# EAGLE design PT08tqfp (EAGLE 6.6.0)

## Sheet 1 of 2
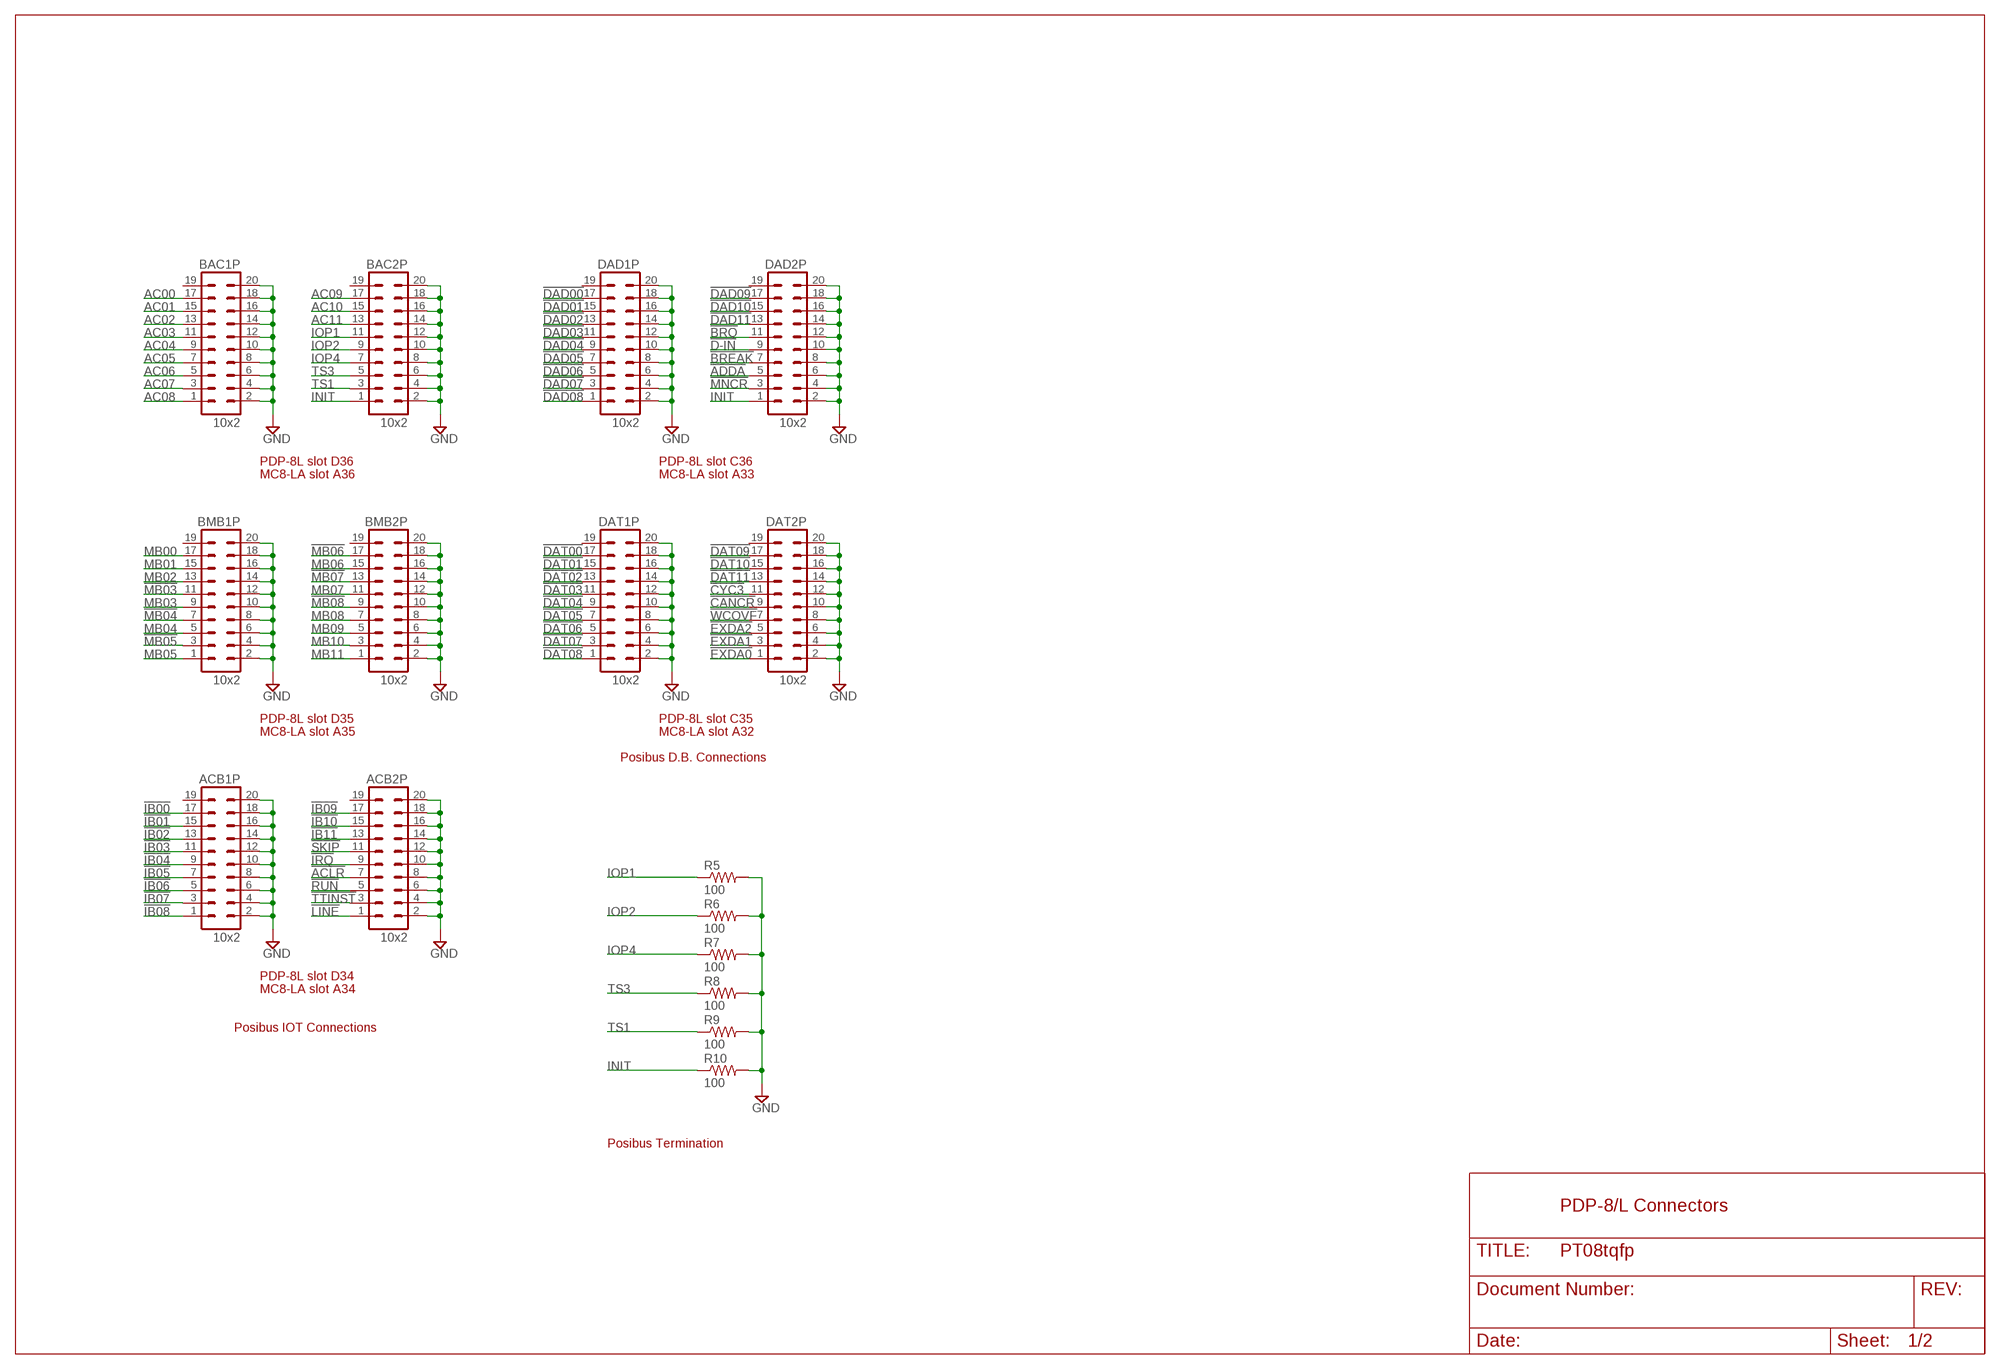
[diagram p0: schematic, sheet 1]

### Parts
ACB1P  10x2  MA10-2  [MA10-2]
ACB2P  10x2  MA10-2  [MA10-2]
BAC1P  10x2  MA10-2  [MA10-2]
BAC2P  10x2  MA10-2  [MA10-2]
BMB1P  10x2  MA10-2  [MA10-2]
BMB2P  10x2  MA10-2  [MA10-2]
DAD1P  10x2  MA10-2  [MA10-2]
DAD2P  10x2  MA10-2  [MA10-2]
DAT1P  10x2  MA10-2  [MA10-2]
DAT2P  10x2  MA10-2  [MA10-2]
R5  100  R-US_R1206  [R1206]
R6  100  R-US_R1206  [R1206]
R7  100  R-US_R1206  [R1206]
R8  100  R-US_R1206  [R1206]
R9  100  R-US_R1206  [R1206]
R10  100  R-US_R1206  [R1206]

### Nets
!ACLR: ACB2P.7 ; also sheet 2
!ADDA: DAD2P.5
!BREAK: DAD2P.7
!BRQ: DAD2P.11
!CANCR: DAT2P.9
!CYC3: DAT2P.11
!D-IN: DAD2P.9
!DAD00: DAD1P.17
!DAD01: DAD1P.15
!DAD02: DAD1P.13
!DAD03: DAD1P.11
!DAD04: DAD1P.9
!DAD05: DAD1P.7
!DAD06: DAD1P.5
!DAD07: DAD1P.3
!DAD08: DAD1P.1
!DAD09: DAD2P.17
!DAD10: DAD2P.15
!DAD11: DAD2P.13
!DAT00: DAT1P.17
!DAT01: DAT1P.15
!DAT02: DAT1P.13
!DAT03: DAT1P.11
!DAT04: DAT1P.9
!DAT05: DAT1P.7
!DAT06: DAT1P.5
!DAT07: DAT1P.3
!DAT08: DAT1P.1
!DAT09: DAT2P.17
!DAT10: DAT2P.15
!DAT11: DAT2P.13
!EXDA0: DAT2P.1
!EXDA1: DAT2P.3
!EXDA2: DAT2P.5
!IB00: ACB1P.17 ; also sheet 2
!IB01: ACB1P.15 ; also sheet 2
!IB02: ACB1P.13 ; also sheet 2
!IB03: ACB1P.11 ; also sheet 2
!IB04: ACB1P.9 ; also sheet 2
!IB05: ACB1P.7 ; also sheet 2
!IB06: ACB1P.5 ; also sheet 2
!IB07: ACB1P.3 ; also sheet 2
!IB08: ACB1P.1 ; also sheet 2
!IB09: ACB2P.17 ; also sheet 2
!IB10: ACB2P.15 ; also sheet 2
!IB11: ACB2P.13 ; also sheet 2
!IRQ: ACB2P.9 ; also sheet 2
!LINE: ACB2P.1 ; also sheet 2
!MB03: BMB1P.11
!MB04: BMB1P.7
!MB05: BMB1P.3
!MB06: BMB2P.17
!MB07: BMB2P.13
!MB08: BMB2P.9
!MNCR: DAD2P.3
!RUN: ACB2P.5 ; also sheet 2
!SKIP: ACB2P.11 ; also sheet 2
!TTINST: ACB2P.3 ; also sheet 2
!WCOVF: DAT2P.7
AC00: BAC1P.17 ; also sheet 2
AC01: BAC1P.15 ; also sheet 2
AC02: BAC1P.13 ; also sheet 2
AC03: BAC1P.11 ; also sheet 2
AC04: BAC1P.9 ; also sheet 2
AC05: BAC1P.7 ; also sheet 2
AC06: BAC1P.5 ; also sheet 2
AC07: BAC1P.3 ; also sheet 2
AC08: BAC1P.1 ; also sheet 2
AC09: BAC2P.17 ; also sheet 2
AC10: BAC2P.15 ; also sheet 2
AC11: BAC2P.13 ; also sheet 2
GND [supply]: ACB1P.2 ACB1P.4 ACB1P.6 ACB1P.8 ACB1P.10 ACB1P.12 ACB1P.14 ACB1P.16 ACB1P.18 ACB1P.20 ACB2P.2 ACB2P.4 ACB2P.6 ACB2P.8 ACB2P.10 ACB2P.12 ACB2P.14 ACB2P.16 ACB2P.18 ACB2P.20 BAC1P.2 BAC1P.4 BAC1P.6 BAC1P.8 BAC1P.10 BAC1P.12 BAC1P.14 BAC1P.16 BAC1P.18 BAC1P.20 BAC2P.2 BAC2P.4 BAC2P.6 BAC2P.8 BAC2P.10 BAC2P.12 BAC2P.14 BAC2P.16 BAC2P.18 BAC2P.20 BMB1P.2 BMB1P.4 BMB1P.6 BMB1P.8 BMB1P.10 BMB1P.12 BMB1P.14 BMB1P.16 BMB1P.18 BMB1P.20 BMB2P.2 BMB2P.4 BMB2P.6 BMB2P.8 BMB2P.10 BMB2P.12 BMB2P.14 BMB2P.16 BMB2P.18 BMB2P.20 DAD1P.2 DAD1P.4 DAD1P.6 DAD1P.8 DAD1P.10 DAD1P.12 DAD1P.14 DAD1P.16 DAD1P.18 DAD1P.20 DAD2P.2 DAD2P.4 DAD2P.6 DAD2P.8 DAD2P.10 DAD2P.12 DAD2P.14 DAD2P.16 DAD2P.18 DAD2P.20 DAT1P.2 DAT1P.4 DAT1P.6 DAT1P.8 DAT1P.10 DAT1P.12 DAT1P.14 DAT1P.16 DAT1P.18 DAT1P.20 DAT2P.2 DAT2P.4 DAT2P.6 DAT2P.8 DAT2P.10 DAT2P.12 DAT2P.14 DAT2P.16 DAT2P.18 DAT2P.20 R5.2 R6.2 R7.2 R8.2 R9.2 R10.2 ; also sheet 2
INIT: BAC2P.1 DAD2P.1 R10.1 ; also sheet 2
IOP1: BAC2P.11 R5.1 ; also sheet 2
IOP2: BAC2P.9 R6.1 ; also sheet 2
IOP4: BAC2P.7 R7.1 ; also sheet 2
MB00: BMB1P.17 ; also sheet 2
MB01: BMB1P.15 ; also sheet 2
MB02: BMB1P.13 ; also sheet 2
MB03: BMB1P.9 ; also sheet 2
MB04: BMB1P.5 ; also sheet 2
MB05: BMB1P.1 ; also sheet 2
MB06: BMB2P.15 ; also sheet 2
MB07: BMB2P.11 ; also sheet 2
MB08: BMB2P.7 ; also sheet 2
MB09: BMB2P.5 ; also sheet 2
MB10: BMB2P.3 ; also sheet 2
MB11: BMB2P.1 ; also sheet 2
TS1: BAC2P.3 R9.1 ; also sheet 2
TS3: BAC2P.5 R8.1 ; also sheet 2
Unconnected: ACB1P.19 ACB2P.19 BAC1P.19 BAC2P.19 BMB1P.19 BMB2P.19 DAD1P.19 DAD2P.19 DAT1P.19 DAT2P.19

### Notes on the sheet
- PDP-8L slot D36 | PDP-8L slot C36
- MC8-LA slot A36 | MC8-LA slot A33
- PDP-8L slot D35 | PDP-8L slot C35
- MC8-LA slot A35 | MC8-LA slot A32
- Posibus D.B. Connections
- PDP-8L slot D34
- MC8-LA slot A34
- Posibus IOT Connections
- Posibus Termination
- PDP-8/L Connectors

## Sheet 2 of 2
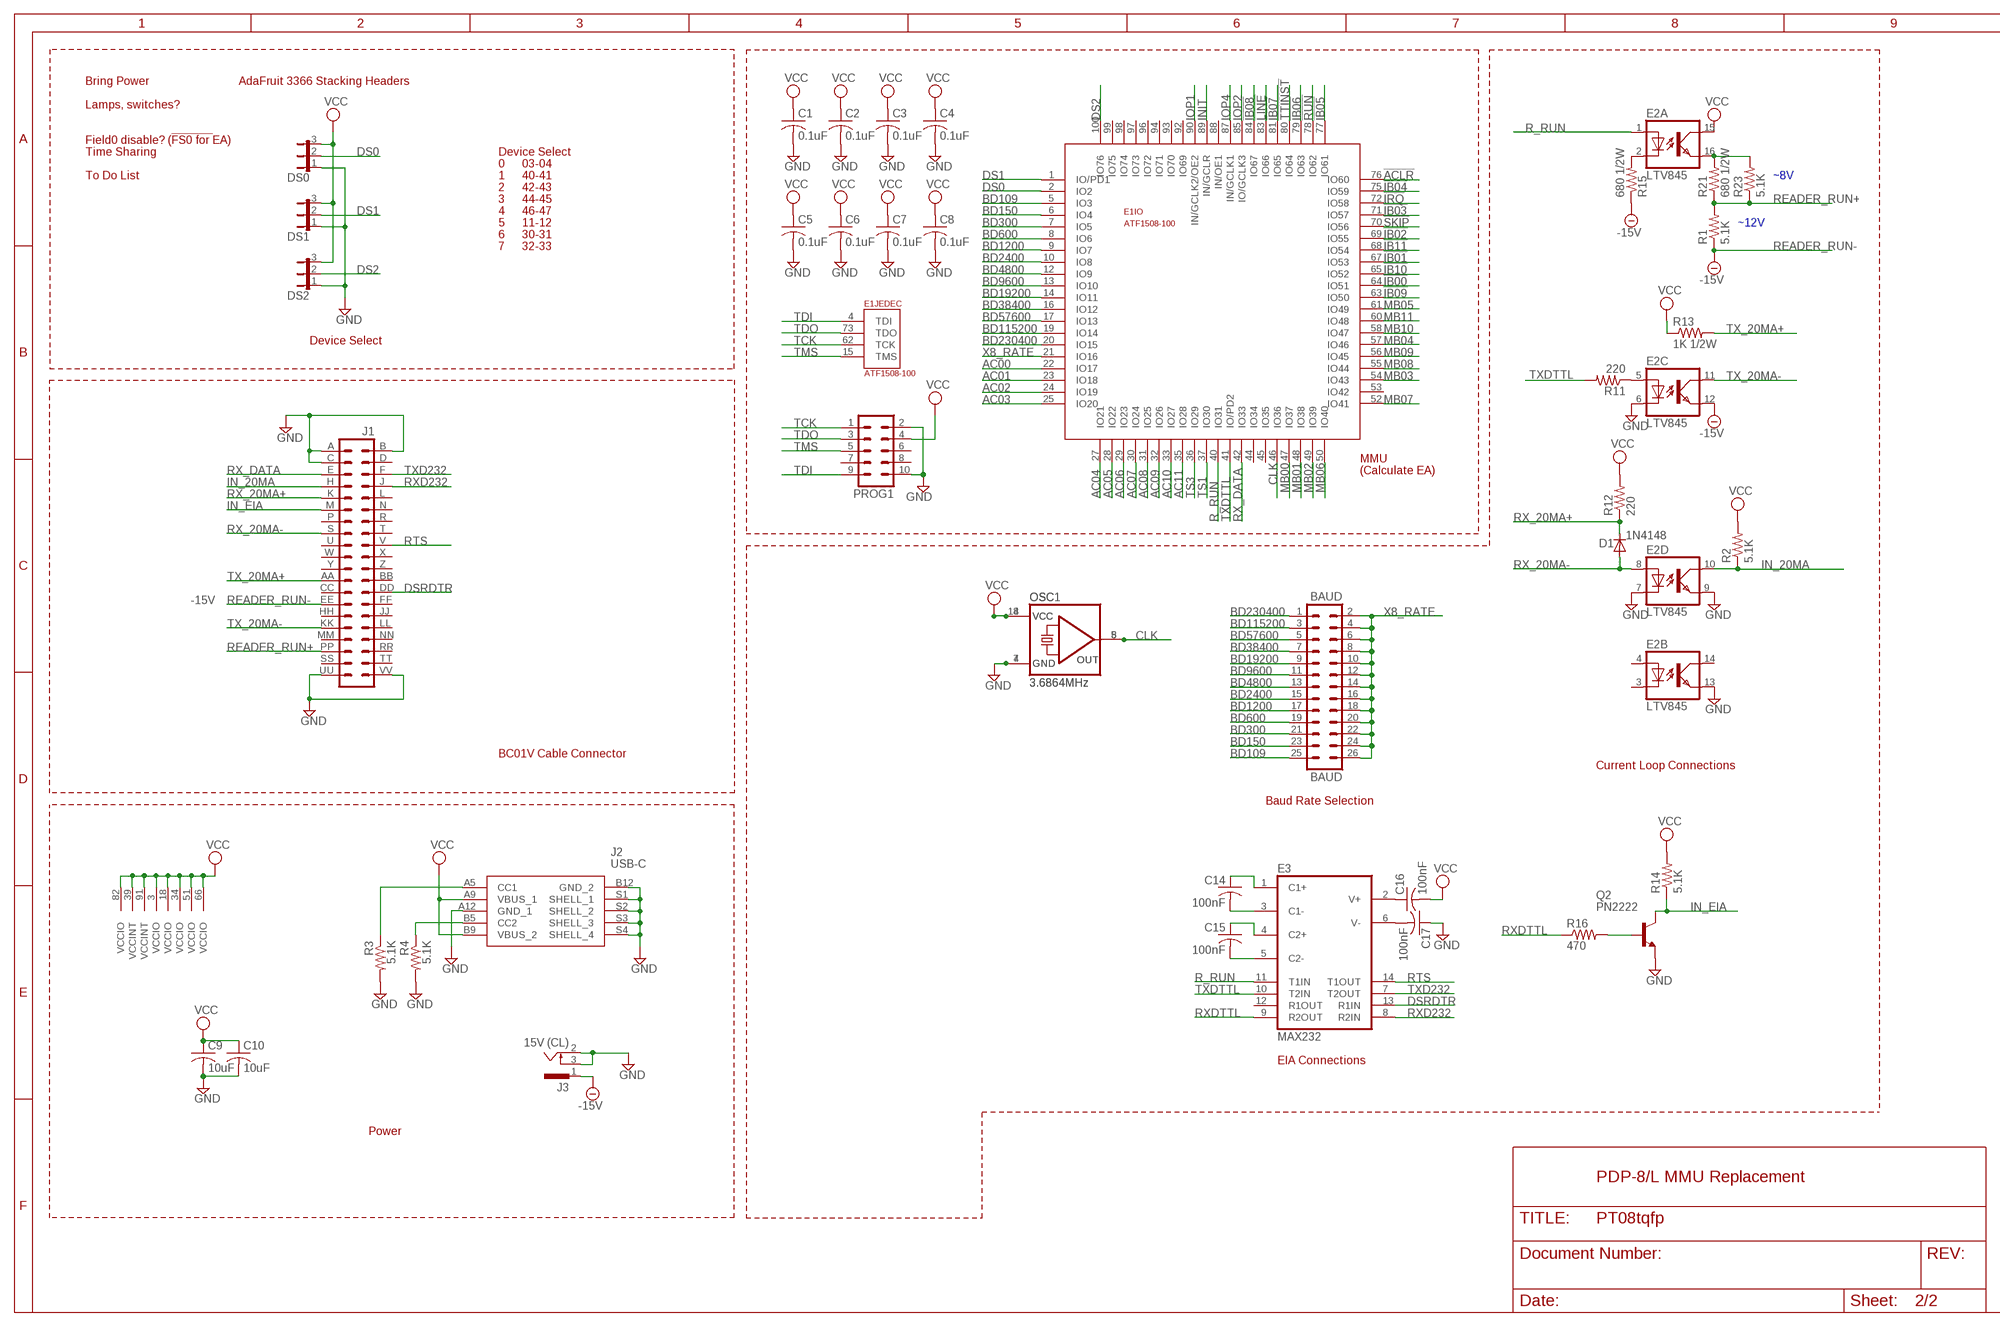
[diagram p1: schematic, sheet 2, part 1 of 2]
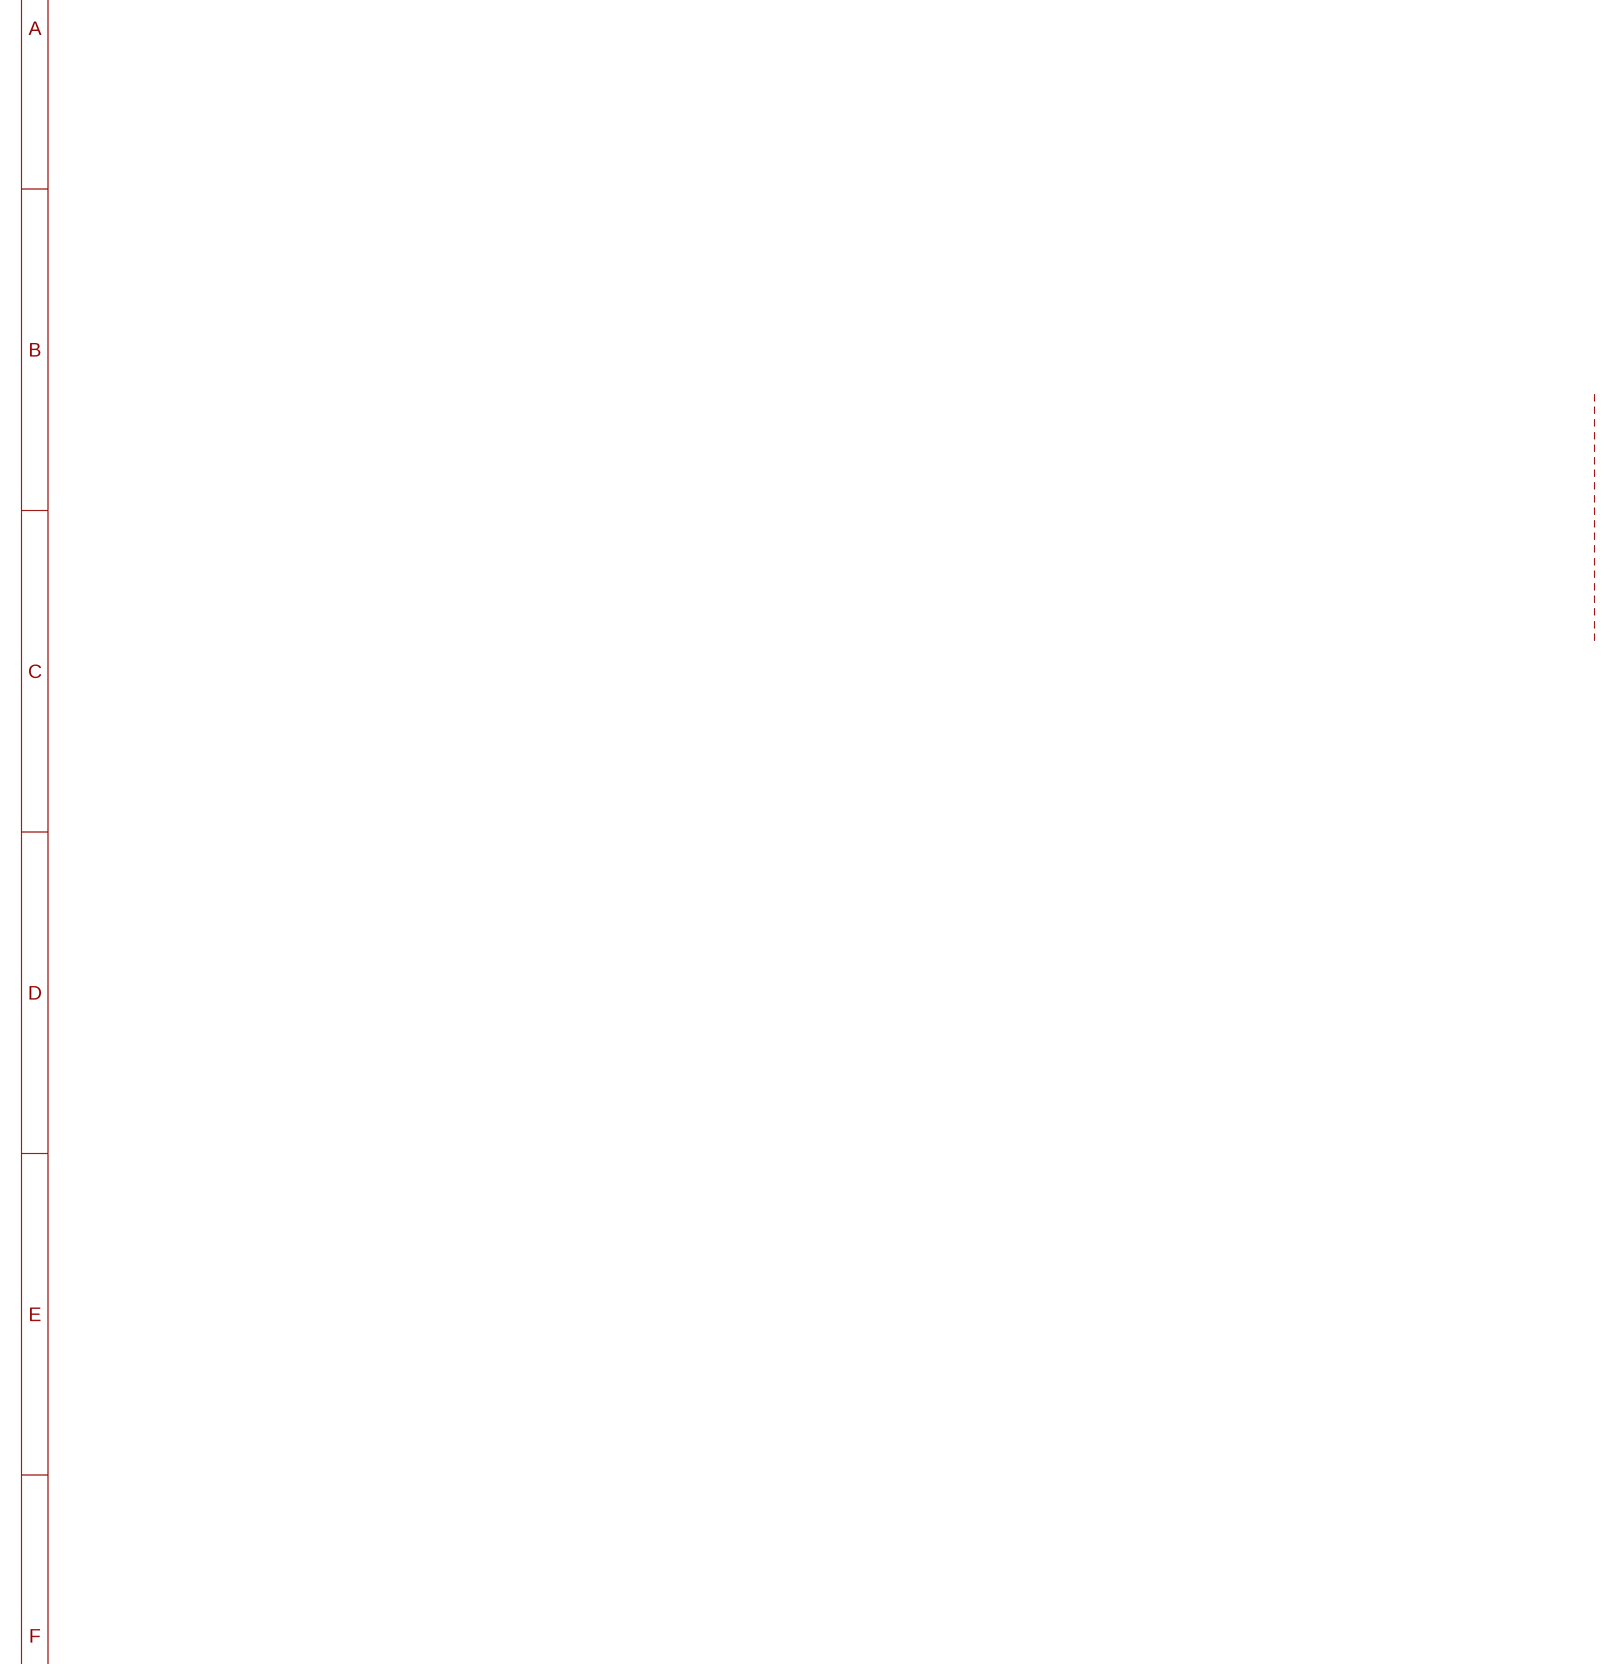
[diagram p2: schematic, sheet 2, part 2 of 2]

### Parts
BAUD  BAUD  MA13-2  [MA13-2]
C1  0.1uF  C-USC0805  [C0805]
C2  0.1uF  C-USC0805  [C0805]
C3  0.1uF  C-USC0805  [C0805]
C4  0.1uF  C-USC0805  [C0805]
C5  0.1uF  C-USC0805  [C0805]
C6  0.1uF  C-USC0805  [C0805]
C7  0.1uF  C-USC0805  [C0805]
C8  0.1uF  C-USC0805  [C0805]
C9  10uF  C-USC0805  [C0805]
C10  10uF  C-USC0805  [C0805]
C14  100nF  C-USC0805  [C0805]
C15  100nF  C-USC0805  [C0805]
C16  100nF  C-USC0805  [C0805]
C17  100nF  C-USC0805  [C0805]
D1  1N4148  DIODE-SOD323-W  [SOD323-W]
DS0  JP2E  [JP2]
DS1  JP2E  [JP2]
DS2  JP2E  [JP2]
E1  ATF1508-100  ATF150X100TQFP  [TQFP-100]
E2  LTV845  ILQ1  [DIL16]
E3  MAX232  [DIL16]
J1  DEC40PINH  [DEC40PINH]
J2  USB-C  USB4970-00-A  [USB497000A]
J3  15V (CL)  SCD-014A  [SCD-014-A]
OSC  3.6864MHz  QG5460  [DIL08S]
OSC1  3.6864MHz  QG5860  [DIL14S]
PROG1  ML10  [ML10]
Q2  PN2222  -NPN-SOT23-EBC  [SOT23-EBC]
R1  5.1K  R-US_R0805  [R0805]
R2  5.1K  R-US_R0805  [R0805]
R3  5.1K  R-US_R0805  [R0805]
R4  5.1K  R-US_R0805  [R0805]
R11  220  R-US_R0805  [R0805]
R12  220  R-US_R0805  [R0805]
R13  1K 1/2W  R-US_0207/10  [0207/10]
R14  5.1K  R-US_R0805  [R0805]
R15  680 1/2W  R-US_0207/10  [0207/10]
R16  470  R-US_R0805  [R0805]
R21  680 1/2W  R-US_0207/10  [0207/10]
R23  5.1K  R-US_R0805  [R0805]

### Nets
!ACLR: E1.76(IO:IO60) ; also sheet 1
!IB00: E1.64(IO:IO51) ; also sheet 1
!IB01: E1.67(IO:IO53) ; also sheet 1
!IB02: E1.69(IO:IO55) ; also sheet 1
!IB03: E1.71(IO:IO57) ; also sheet 1
!IB04: E1.75(IO:IO59) ; also sheet 1
!IB05: E1.77(IO:IO61) ; also sheet 1
!IB06: E1.79(IO:IO63) ; also sheet 1
!IB07: E1.81(IO:IO65) ; also sheet 1
!IB08: E1.84(IO:IO67) ; also sheet 1
!IB09: E1.63(IO:IO50) ; also sheet 1
!IB10: E1.65(IO:IO52) ; also sheet 1
!IB11: E1.68(IO:IO54) ; also sheet 1
!IRQ: E1.72(IO:IO58) ; also sheet 1
!LINE: E1.83(IO:IO66) ; also sheet 1
!RUN: E1.78(IO:IO62) ; also sheet 1
!SKIP: E1.70(IO:IO56) ; also sheet 1
!TTINST: E1.80(IO:IO64) ; also sheet 1
-15V [supply]: E2.12(C:EMIT) J1.EE J3.1 R1.1 R15.1
AC00: E1.22(IO:IO17) ; also sheet 1
AC01: E1.23(IO:IO18) ; also sheet 1
AC02: E1.24(IO:IO19) ; also sheet 1
AC03: E1.25(IO:IO20) ; also sheet 1
AC04: E1.27(IO:IO21) ; also sheet 1
AC05: E1.28(IO:IO22) ; also sheet 1
AC06: E1.29(IO:IO23) ; also sheet 1
AC07: E1.30(IO:IO24) ; also sheet 1
AC08: E1.31(IO:IO25) ; also sheet 1
AC09: E1.32(IO:IO26) ; also sheet 1
AC10: E1.33(IO:IO27) ; also sheet 1
AC11: E1.35(IO:IO28) ; also sheet 1
BD109: BAUD.25 E1.5(IO:IO3)
BD150: BAUD.23 E1.6(IO:IO4)
BD300: BAUD.21 E1.7(IO:IO5)
BD600: BAUD.19 E1.8(IO:IO6)
BD1200: BAUD.17 E1.9(IO:IO7)
BD2400: BAUD.15 E1.10(IO:IO8)
BD4800: BAUD.13 E1.12(IO:IO9)
BD9600: BAUD.11 E1.13(IO:IO10)
BD19200: BAUD.9 E1.14(IO:IO11)
BD38400: BAUD.7 E1.16(IO:IO12)
BD57600: BAUD.5 E1.17(IO:IO13)
BD115200: BAUD.3 E1.19(IO:IO14)
BD230400: BAUD.1 E1.20(IO:IO15)
CLK: E1.46(IO:IO36) OSC1.8(OUT) OSC.5(OUT)
DS0: DS0.2 E1.2(IO:IO2)
DS1: DS1.2 E1.1(IO:IO/PD1)
DS2: DS2.2 E1.100(IO:IO76)
DSRDTR: E3.13(R1IN) J1.DD
GND [supply]: C1.2 C2.2 C3.2 C4.2 C5.2 C6.2 C7.2 C8.2 C9.2 C10.2 C17.1 DS0.1 DS1.1 DS2.1 E2.6(C:C) E2.7(D:C) E2.9(D:EMIT) E2.13(B:EMIT) J1.A J1.B J1.C J1.UU J1.VV J2.A12(GND_1) J2.B12(GND_2) J2.S1(SHELL_1) J2.S2(SHELL_2) J2.S3(SHELL_3) J2.S4(SHELL_4) J3.2 J3.3 OSC1.7(GND) OSC.4(GND) PROG1.2 PROG1.10 Q2.E R3.2 R4.2 ; also sheet 1
IN_20MA: E2.10(D:COL) J1.H R2.1
IN_EIA: J1.M Q2.C R14.1
INIT: E1.89(IO:IN/GCLR) ; also sheet 1
IOP1: E1.90(IO:IN/GCLK2/OE2) ; also sheet 1
IOP2: E1.85(IO:IO/GCLK3) ; also sheet 1
IOP4: E1.87(IO:IN/GCLK1) ; also sheet 1
MB00: E1.47(IO:IO37) ; also sheet 1
MB01: E1.48(IO:IO38) ; also sheet 1
MB02: E1.49(IO:IO39) ; also sheet 1
MB03: E1.54(IO:IO43) ; also sheet 1
MB04: E1.57(IO:IO46) ; also sheet 1
MB05: E1.61(IO:IO49) ; also sheet 1
MB06: E1.50(IO:IO40) ; also sheet 1
MB07: E1.52(IO:IO41) ; also sheet 1
MB08: E1.55(IO:IO44) ; also sheet 1
MB09: E1.56(IO:IO45) ; also sheet 1
MB10: E1.58(IO:IO47) ; also sheet 1
MB11: E1.60(IO:IO48) ; also sheet 1
N$1: J2.B5(CC2) R4.1
N$2: E2.2(A:C) R15.2
N$5: J2.A5(CC1) R3.1
N$7: E2.16(A:EMIT) R21.2 R23.2
N$11: Q2.B R16.2
N$15: E2.5(C:A) R11.1
N$16: C17.2 E3.6(V-)
N$17: C14.1 E3.1(C1+)
N$827: C14.2 E3.3(C1-)
N$914: C15.2 E3.5(C2-)
N$915: C15.1 E3.4(C2+)
N$916: C16.1 E3.2(V+)
R_RUN: E1.40(IO:IO31) E2.1(A:A) E3.11(T1IN)
READER_RUN+ [supply]: J1.PP R1.2 R21.1 R23.1
RTS: E3.14(T1OUT) J1.V
RX_20MA+ [supply]: D1.C J1.K R12.1
RX_20MA- [supply]: D1.A E2.8(D:A) J1.S
RX_DATA: E1.42(IO:IO33) J1.E
RXD232: E3.8(R2IN) J1.J
RXDTTL: E3.9(R2OUT) R16.1
TCK: E1.62(JEDEC:TCK) PROG1.1
TDI: E1.4(JEDEC:TDI) PROG1.9
TDO: E1.73(JEDEC:TDO) PROG1.3
TMS: E1.15(JEDEC:TMS) PROG1.5
TS1: E1.37(IO:IO30) ; also sheet 1
TS3: E1.36(IO:IO29) ; also sheet 1
TX_20MA+ [supply]: J1.AA R13.2
TX_20MA- [supply]: E2.11(C:COL) J1.KK
TXD232: E3.7(T2OUT) J1.F
TXDTTL: E1.41(IO:IO/PD2) E3.10(T2IN) R11.2
VCC [supply]: C1.1 C2.1 C3.1 C4.1 C5.1 C6.1 C7.1 C8.1 C9.1 C10.1 C16.2 DS0.3 DS1.3 DS2.3 E1.3(VCCIO) E1.18(VCCIO) E1.34(VCCIO) E1.39(VCCINT) E1.51(VCCIO) E1.66(VCCIO) E1.82(VCCIO) E1.91(VCCINT) E2.15(A:COL) J2.A9(VBUS_1) J2.B9(VBUS_2) OSC1.14(VCC) OSC.8(VCC) PROG1.4 R2.2 R12.2 R13.1 R14.2
X8_RATE: BAUD.2 BAUD.4 BAUD.6 BAUD.8 BAUD.10 BAUD.12 BAUD.14 BAUD.16 BAUD.18 BAUD.20 BAUD.22 BAUD.24 BAUD.26 E1.21(IO:IO16)
Unconnected: E1.44(IO:IO34) E1.45(IO:IO35) E1.53(IO:IO42) E1.88(IO:IN/OE1) E1.92(IO:IO69) E1.93(IO:IO70) E1.94(IO:IO71) E1.96(IO:IO72) E1.97(IO:IO73) E1.98(IO:IO74) E1.99(IO:IO75) E2.3(B:C) E2.4(B:A) E2.14(B:COL) E3.12(R1OUT) J1.BB J1.CC J1.D J1.FF J1.HH J1.JJ J1.L J1.LL J1.MM J1.N J1.NN J1.P J1.R J1.RR J1.SS J1.T J1.TT J1.U J1.W J1.X J1.Y J1.Z PROG1.6 PROG1.7 PROG1.8

### Notes on the sheet
- Bring Power | AdaFruit 3366 Stacking Headers
- Lamps, switches?
- Field0 disable? | (!FS0 for !EA)
- Time Sharing | Device Select
- 0 | 03-04
- To Do List | 1 | 40-41 | ~8V
- 2 | 42-43
- 3 | 44-45
- 4 | 46-47
- 5 | 11-12 | ~12V
- 6 | 30-31
- 7 | 32-33 | READER_RUN-
- Device Select
- MMU
- (Calculate EA)
- READER_RUN-
- BC01V Cable Connector
- Current Loop Connections
- Baud Rate Selection
- EIA Connections
- Power
- PDP-8/L MMU Replacement

## Power pins joined to a net without a drawn wire
GND: E1.11(GND) E1.26(GND) E1.38(GND) E1.43(GND) E1.59(GND) E1.74(GND) E1.86(GND) E1.95(GND) E3.15(GND)
VCC: E3.16(VCC)

## Library data of the parts
ACB1P ACB2P BAC1P BAC2P BMB1P BMB2P DAD1P DAD2P DAT1P DAT2P = con-lstb:MA10-2: PIN HEADER; OC_FARNELL: unknown; OC_NEWARK: unknown
BAUD = con-lstb:MA13-2: PIN HEADER; OC_FARNELL: unknown; OC_NEWARK: unknown
C1-C10 C14-C17 = rcl:C-US: CAPACITOR, American symbol
D1 = diode:DIODE-: DIODE
DS0 DS1 DS2 = jumper:JP2E: JUMPER
E1 = atmel-cpld:ATF150X100: ATF150x in 100 pin package.
E2 = optocoupler:ILQ1: SIEMENS OPTO COUPLER; MF: VISHAY/TELEFUNKEN; MPN: ILQ1; OC_FARNELL: 1469501; OC_NEWARK: 88K1954
E3 = maxim:MAX232: RS232 TRANSCEIVER; MF: MAXIM; MPN: MAX232ACPE+; OC_FARNELL: 9723773; OC_NEWARK: 68K4544
J1 = dec-con:DEC40PIN: PIN HEADER
J2 = USB4970-00-A:USB4970-00-A: USB-C (USB TYPE-C) Receptacle Connector 24 (6+18 Dummy) Position Surface Mount, Right Angle; Through Hole Source: Datasheet <3dcadmodel>; DESCRIPTION: USB-C (USB TYPE-C) Receptacle Connector 24 (6+18 Dummy) Position Surface Mount, Right Angle; Through Hole; HEIGHT: 3.41mm; MANUFACTURER_NAME: GCT (GLOBAL CONNECTOR TECHNOLOGY); MANUFACTURER_PART_NUMBER: USB4970-00-A
J3 = con-shiua-chyuan:SCD-014A: Power Jack 2.5mm; OC_FARNELL: unknown; OC_NEWARK: unknown
OSC = crystal:QG5460: CRYSTAL RESONATOR; OC_FARNELL: unknown; OC_NEWARK: unknown
OSC1 = crystal:QG5860: CRYSTAL RESONATOR; OC_FARNELL: unknown; OC_NEWARK: unknown
PROG1 = con-harting-ml:ML10: HARTING; OC_FARNELL: unknown; OC_NEWARK: unknown
Q2 = transistor:*-NPN-: NPN Transistror BF959 corrected 2008.03.06
R1-R16 R21 R23 = rcl:R-US_: RESISTOR, American symbol

## Net classes
0 default: width 0.356 mm
1 supply: width 0.356 mm

## Board
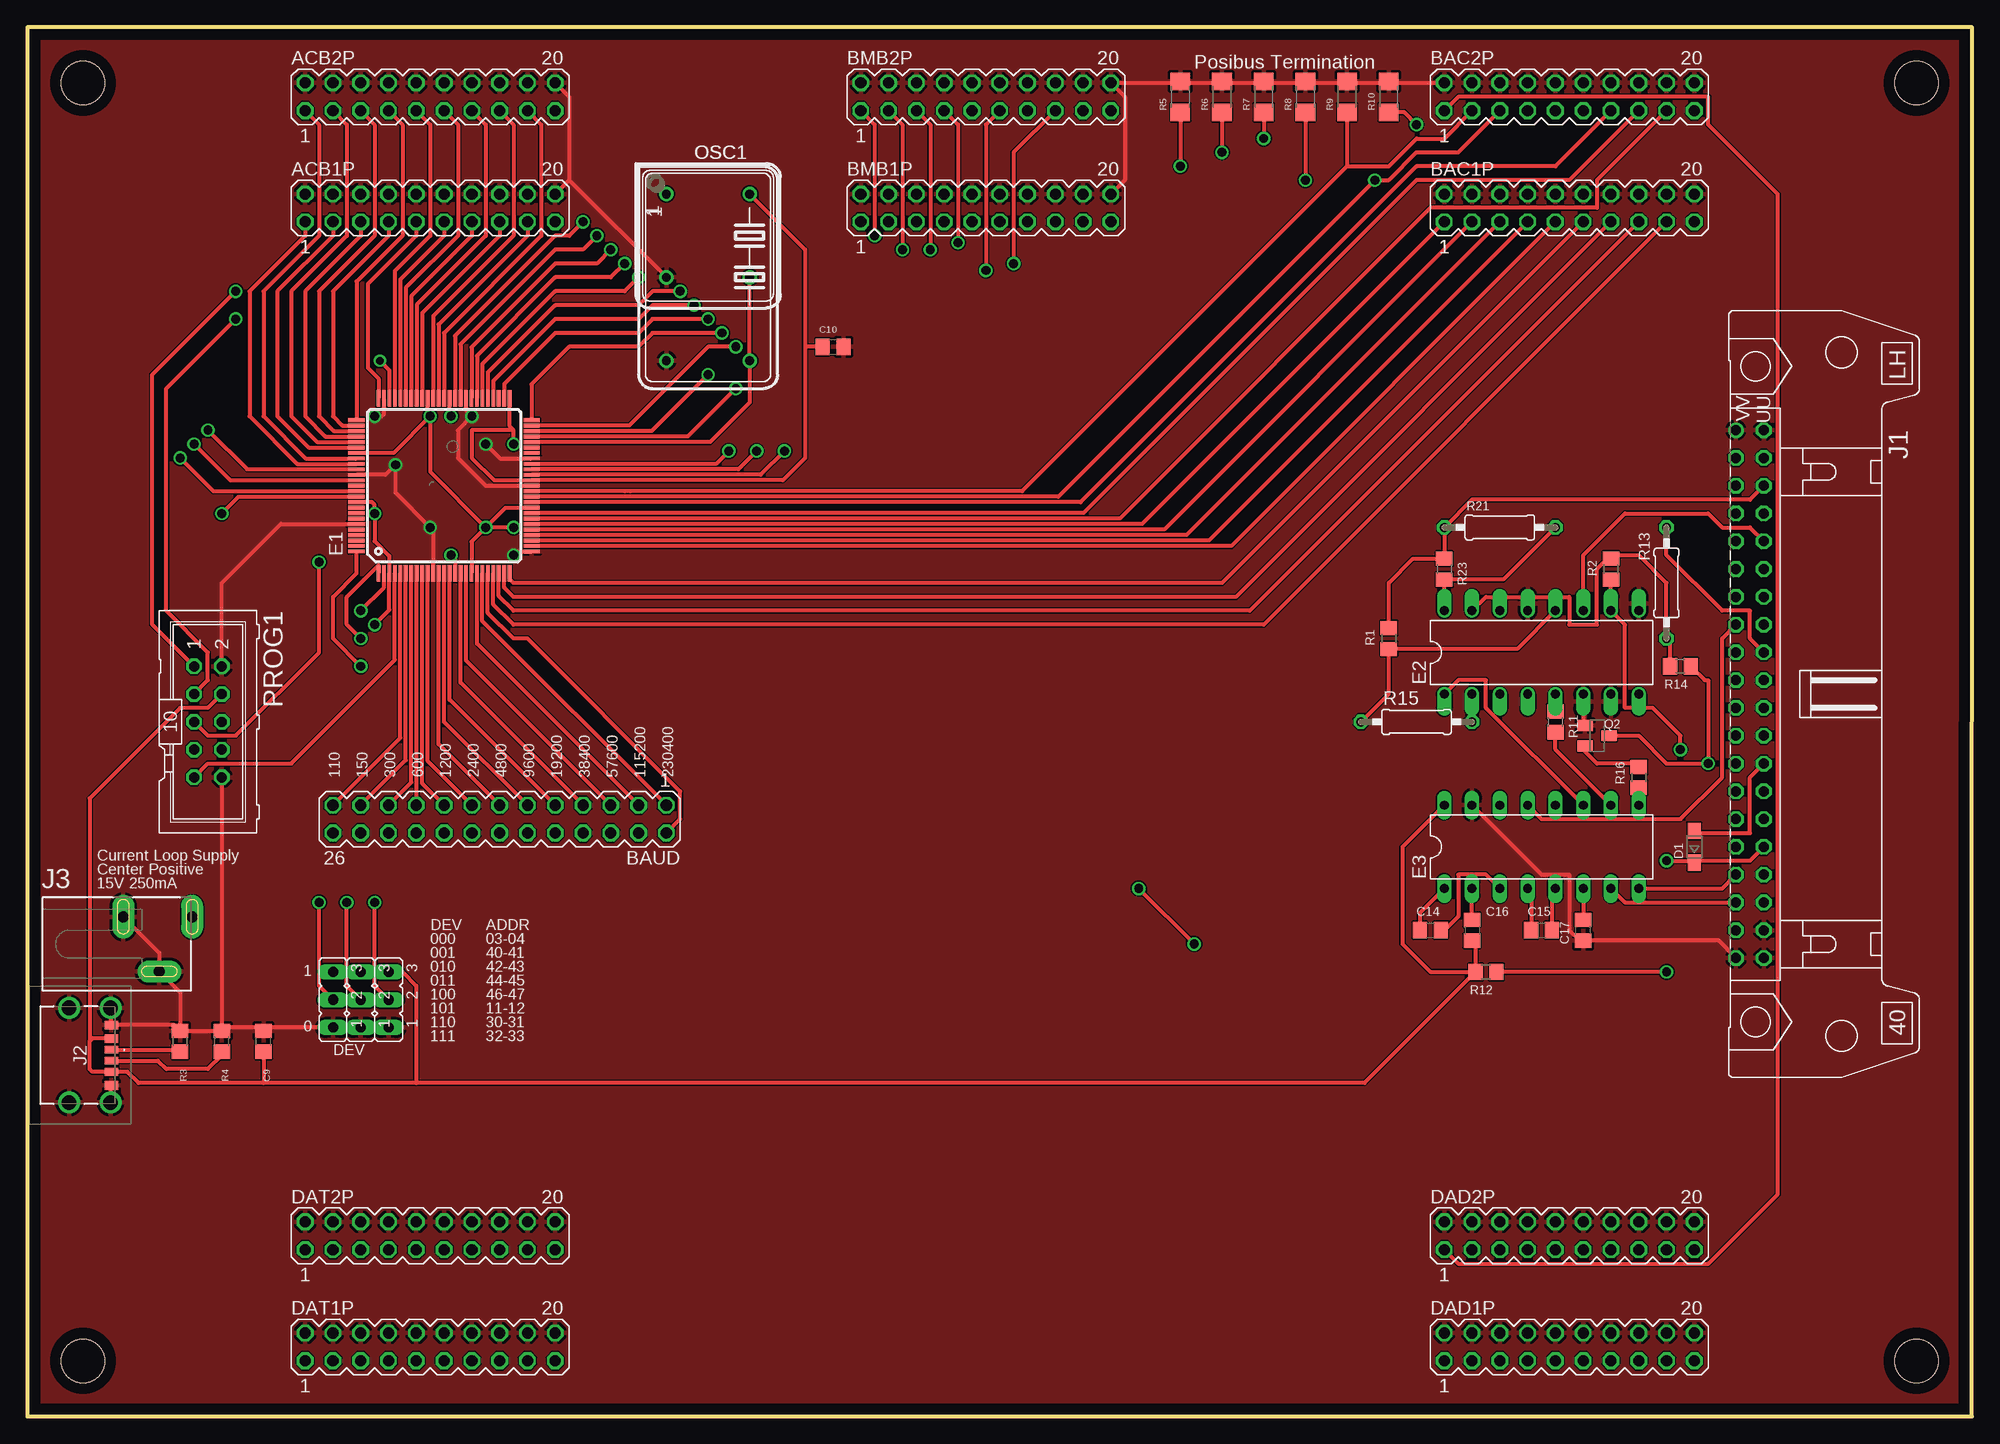
[diagram p3: board, top side]
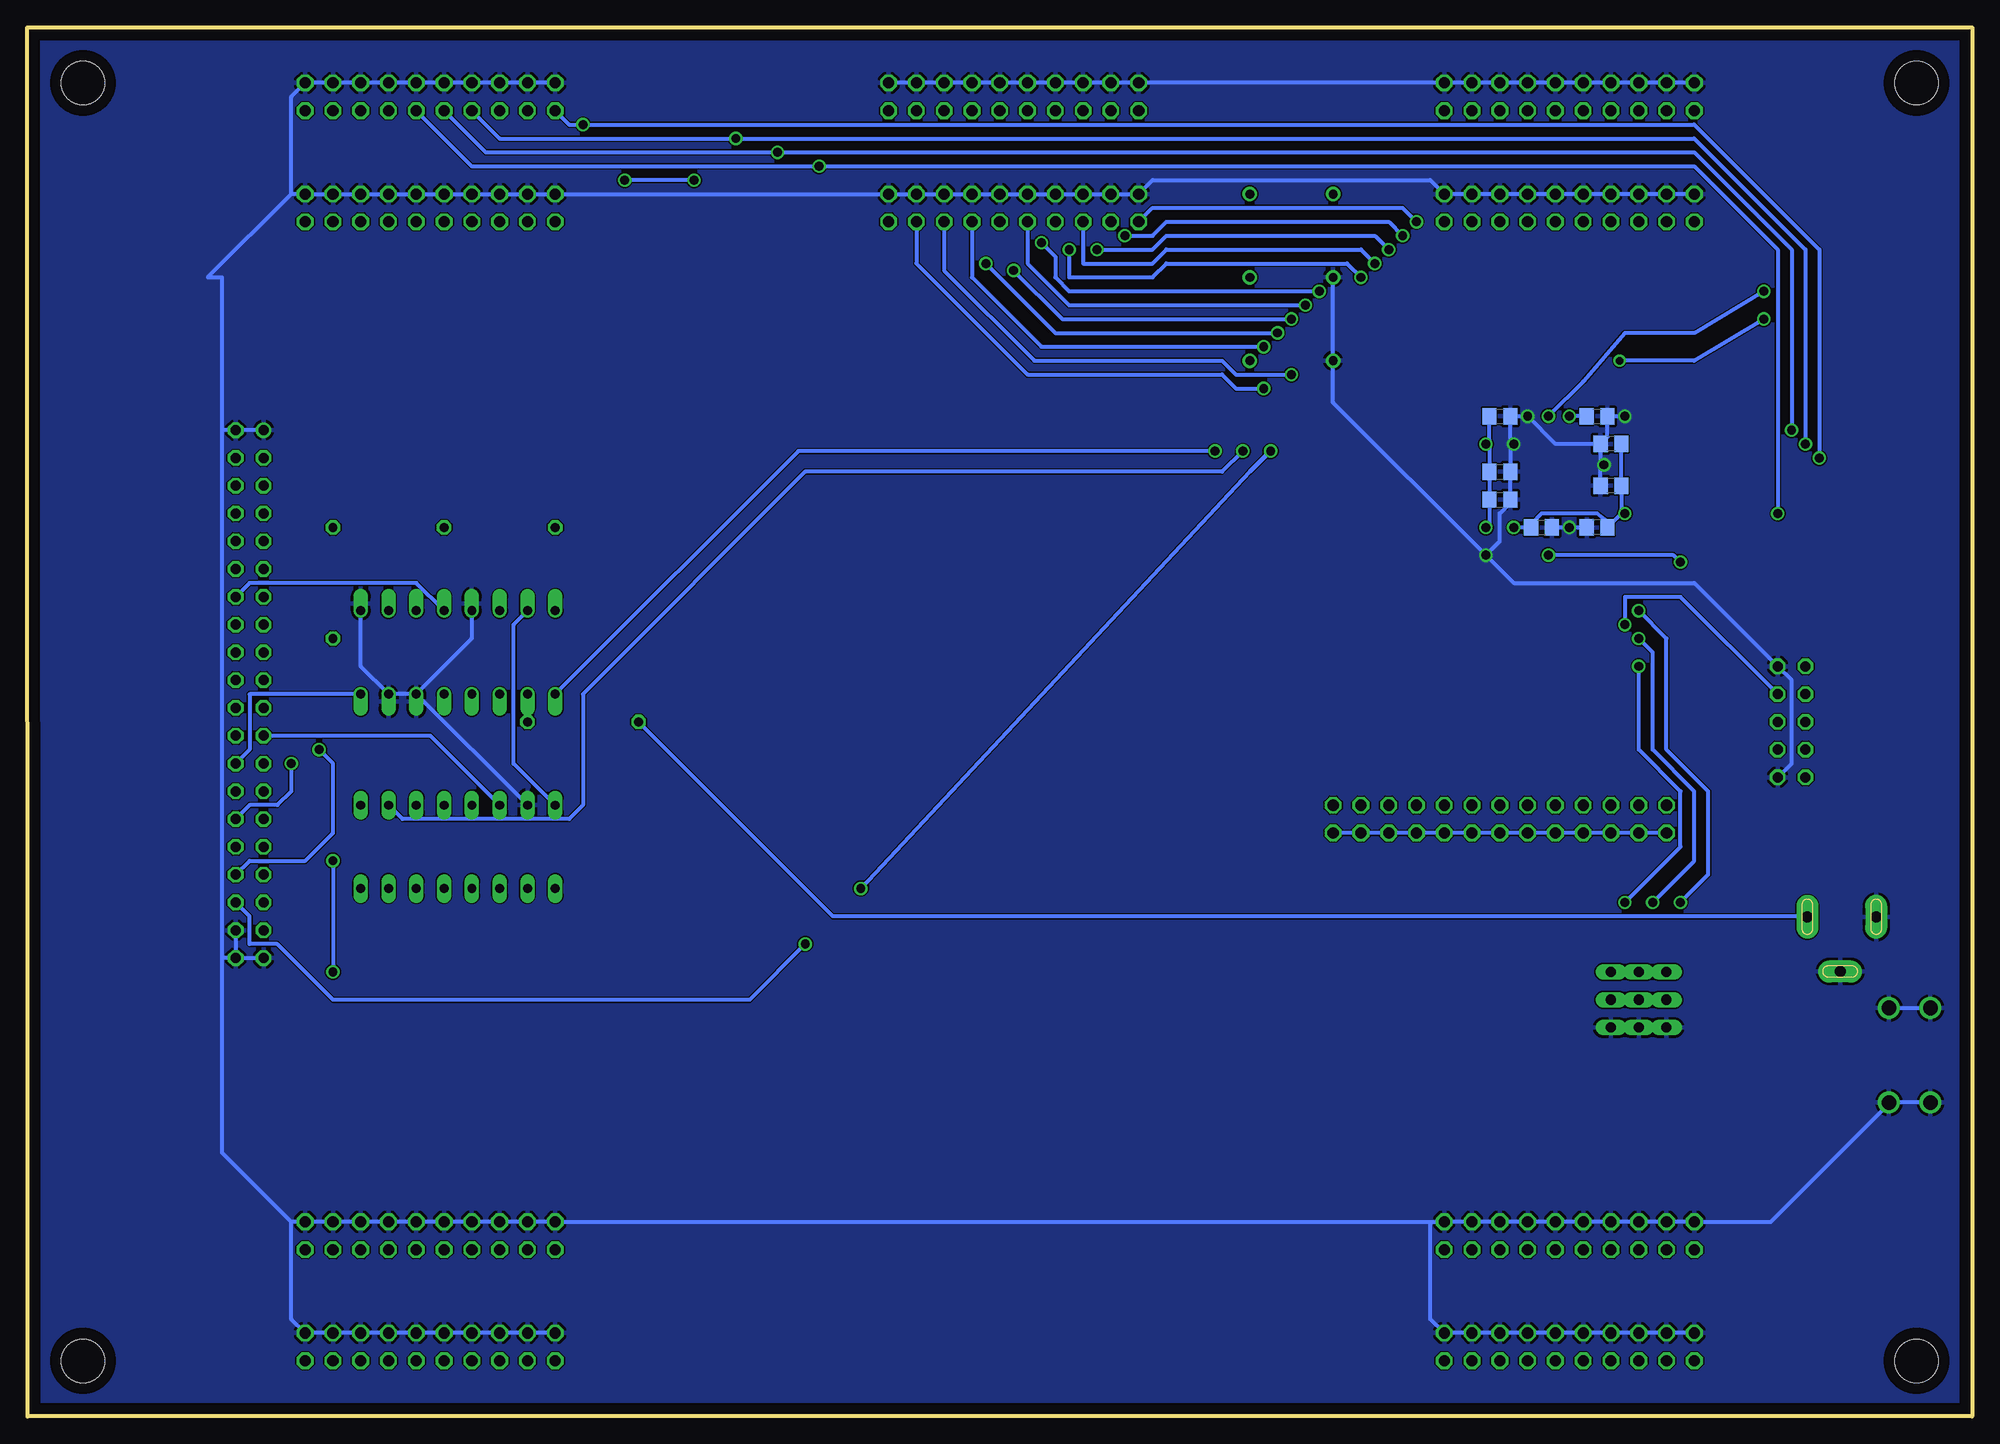
[diagram p4: board, bottom side, seen from below]

Size 177.8 x 127 mm. Coordinates in mm from the lower left corner, seen from the top.
Outline: 0,0 177.78,0 177.8,127 0,127 0,0
Copper layers (1*16): Top 0.035mm / dielectric 1.5mm / Bottom 0.035mm
Design rules "default *": minimum track width 10mil, minimum drill 24mil, track to track 5mil, track to pad 5mil, pad to pad 5mil, via to via 10mil, smd to smd 5mil, copper to edge 40mil, drill to drill 8mil, minimum pad ring 10mil, minimum via ring 8mil, stop-mask expansion 4mil, vias tented up to drill 0mil, thermal gap 10mil
Holes 3.97 mm at 5.08,121.92 172.72,121.92 172.72,5.08 5.08,5.08

### Footprints (pad centres in the part's own frame; a part is rotated, then mirrored left to right if it is on the bottom)
MA10-2 = drill 1.016 octagon: 1 -11.43,-1.27; 2 -11.43,1.27; 3 -8.89,-1.27; 4 -8.89,1.27; 5 -6.35,-1.27; 6 -6.35,1.27; 7 -3.81,-1.27; 8 -3.81,1.27; 9 -1.27,-1.27; 10 -1.27,1.27; 11 1.27,-1.27; 12 1.27,1.27; 13 3.81,-1.27; 14 3.81,1.27; 15 6.35,-1.27; 16 6.35,1.27; 17 8.89,-1.27; 18 8.89,1.27; 19 11.43,-1.27; 20 11.43,1.27
MA13-2 = drill 1.016 octagon: 1 -15.24,-1.27; 2 -15.24,1.27; 3 -12.7,-1.27; 4 -12.7,1.27; 5 -10.16,-1.27; 6 -10.16,1.27; 7 -7.62,-1.27; 8 -7.62,1.27; 9 -5.08,-1.27; 10 -5.08,1.27; 11 -2.54,-1.27; 12 -2.54,1.27; 13 0,-1.27; 14 0,1.27; 15 2.54,-1.27; 16 2.54,1.27; 17 5.08,-1.27; 18 5.08,1.27; 19 7.62,-1.27; 20 7.62,1.27; 21 10.16,-1.27; 22 10.16,1.27; 23 12.7,-1.27; 24 12.7,1.27; 25 15.24,-1.27; 26 15.24,1.27
C0805 = smd 1.3 x 1.5: 1 -0.95,0; 2 0.95,0
SOD323-W = smd 1.5 x 1.2: A 1.45,0; C -1.45,0
JP2 = drill 0.914 long: 1 -2.54,0; 2 0,0; 3 2.54,0
TQFP-100 = smd 1.5 x 0.35: 1 -8,6; 2 -8,5.5; 3 -8,5; 4 -8,4.5; 5 -8,4; 6 -8,3.5; 7 -8,3; 8 -8,2.5; 9 -8,2; 10 -8,1.5; 11 -8,1; 12 -8,0.5; 13 -8,0; 14 -8,-0.5; 15 -8,-1; 16 -8,-1.5; 17 -8,-2; 18 -8,-2.5; 19 -8,-3; 20 -8,-3.5; 21 -8,-4; 22 -8,-4.5; 23 -8,-5; 24 -8,-5.5; 25 -8,-6; 51 8,-6; 52 8,-5.5; 53 8,-5; 54 8,-4.5; 55 8,-4; 56 8,-3.5; 57 8,-3; 58 8,-2.5; 59 8,-2; 60 8,-1.5; 61 8,-1; 62 8,-0.5; 63 8,0; 64 8,0.5; 65 8,1; 66 8,1.5; 67 8,2; 68 8,2.5; 69 8,3; 70 8,3.5; 71 8,4; 72 8,4.5; 73 8,5; 74 8,5.5; 75 8,6 | smd 0.35 x 1.5: 26 -6,-8; 27 -5.5,-8; 28 -5,-8; 29 -4.5,-8; 30 -4,-8; 31 -3.5,-8; 32 -3,-8; 33 -2.5,-8; 34 -2,-8; 35 -1.5,-8; 36 -1,-8; 37 -0.5,-8; 38 0,-8; 39 0.5,-8; 40 1,-8; 41 1.5,-8; 42 2,-8; 43 2.5,-8; 44 3,-8; 45 3.5,-8; 46 4,-8; 47 4.5,-8; 48 5,-8; 49 5.5,-8; 50 6,-8; 76 6,8; 77 5.5,8; 78 5,8; 79 4.5,8; 80 4,8; 81 3.5,8; 82 3,8; 83 2.5,8; 84 2,8; 85 1.5,8; 86 1,8; 87 0.5,8; 88 0,8; 89 -0.5,8; 90 -1,8; 91 -1.5,8; 92 -2,8; 93 -2.5,8; 94 -3,8; 95 -3.5,8; 96 -4,8; 97 -4.5,8; 98 -5,8; 99 -5.5,8; 100 -6,8
DIL16 = drill 0.813 offset: 1 -8.89,-3.81; 2 -6.35,-3.81; 3 -3.81,-3.81; 4 -1.27,-3.81; 5 1.27,-3.81; 6 3.81,-3.81; 7 6.35,-3.81; 8 8.89,-3.81; 9 8.89,3.81; 10 6.35,3.81; 11 3.81,3.81; 12 1.27,3.81; 13 -1.27,3.81; 14 -3.81,3.81; 15 -6.35,3.81; 16 -8.89,3.81
DIL16' = drill 0.813 long: 1 -8.89,-3.81; 2 -6.35,-3.81; 3 -3.81,-3.81; 4 -1.27,-3.81; 5 1.27,-3.81; 6 3.81,-3.81; 7 6.35,-3.81; 8 8.89,-3.81; 9 8.89,3.81; 10 6.35,3.81; 11 3.81,3.81; 12 1.27,3.81; 13 -1.27,3.81; 14 -3.81,3.81; 15 -6.35,3.81; 16 -8.89,3.81
DEC40PINH = drill 0.914 octagon: A 24.13,1.27; AA -3.81,1.27; B 24.13,-1.27; BB -3.81,-1.27; C 21.59,1.27; CC -6.35,1.27; D 21.59,-1.27; DD -6.35,-1.27; E 19.05,1.27; EE -8.89,1.27; F 19.05,-1.27; FF -8.89,-1.27; H 16.51,1.27; HH -11.43,1.27; J 16.51,-1.27; JJ -11.43,-1.27; K 13.97,1.27; KK -13.97,1.27; L 13.97,-1.27; LL -13.97,-1.27; M 11.43,1.27; MM -16.51,1.27; N 11.43,-1.27; NN -16.51,-1.27; P 8.89,1.27; PP -19.05,1.27; R 8.89,-1.27; RR -19.05,-1.27; S 6.35,1.27; SS -21.59,1.27; T 6.35,-1.27; TT -21.59,-1.27; U 3.81,1.27; UU -24.13,1.27; V 3.81,-1.27; W 1.27,1.27; X 1.27,-1.27; Y -1.27,1.27; Z -1.27,-1.27 | drill 0.914: VV -24.13,-1.27
USB497000A = smd 0.7 x 1.2: A5 -0.5,3.88; B5 0.5,3.88 | smd 0.76 x 1.2: A9 1.52,3.88; B9 -1.52,3.88 | smd 0.8 x 1.2: A12 2.75,3.88; B12 -2.75,3.88 | drill 1.34 pad 1.7: S1 -4.32,3.8; S2 4.32,3.8 | drill 1.34 pad 2.01: S3 -4.32,0; S4 4.32,0
SCD-014-A = drill 1 pad 2 long: 1 -2.5,13.8; 2 -2.5,7.5; 3 2.5,10.8
DIL08S = drill 0.813: 1 -3.81,-3.81; 4 3.81,-3.81; 5 3.81,3.81; 8 -3.81,3.81
DIL14S = drill 0.813: 1 -7.62,-3.81; 7 7.62,-3.81; 8 7.62,3.81; 14 -7.62,3.81
ML10 = drill 0.914 octagon: 1 -5.08,-1.27; 2 -5.08,1.27; 3 -2.54,-1.27; 4 -2.54,1.27; 5 0,-1.27; 6 0,1.27; 7 2.54,-1.27; 8 2.54,1.27; 9 5.08,-1.27; 10 5.08,1.27
SOT23-EBC = smd 1 x 1.4: B 0.95,-1.1; C 0,1.1; E -0.95,-1.1
R0805 = smd 1.3 x 1.5: 1 -0.95,0; 2 0.95,0
R1206 = smd 1.6 x 1.803: 1 -1.422,0; 2 1.422,0
0207/10 = drill 0.813 octagon: 1 -5.08,0; 2 5.08,0

### Placement (x,y rotation side)
ACB1P  36.83,110.49 0 top
ACB2P  36.83,120.65 0 top
BAC1P  140.97,110.49 0 top
BAC2P  140.97,120.65 0 top
BAUD  43.18,54.61 180 top
BMB1P  87.63,110.49 0 top
BMB2P  87.63,120.65 0 top
C1  33.02,85.09 180 bottom
C2  43.18,86.36 0 bottom
C3  34.29,81.28 180 bottom
C4  39.37,81.28 0 bottom
C5  43.18,83.82 0 bottom
C6  43.18,91.44 0 bottom
C7  34.29,91.44 0 bottom
C8  33.02,88.9 180 bottom
C9  21.59,34.29 90 top
C10  73.66,97.79 0 top
C14  128.27,44.45 0 top
C15  138.43,44.45 0 top
C16  132.08,44.45 270 top
C17  142.24,44.45 90 top
D1  152.4,52.07 90 top
DAD1P  140.97,6.35 0 top
DAD2P  140.97,16.51 0 top
DAT1P  36.83,6.35 0 top
DAT2P  36.83,16.51 0 top
DS0  27.94,38.1 90 top
DS1  30.48,38.1 90 top
DS2  33.02,38.1 90 top
E1  38.1,85.09 90 top
E2  138.43,69.85 0 top
E3  MAX232  [DIL16']  138.43,52.07 0 top
J1  157.48,66.04 270 top
J2  3.81,33.02 270 top
J3  1.27,43.18 270 top
OSC  62.23,107.95 270 top
OSC1  62.23,104.14 270 top
PROG1  16.51,63.5 270 top
Q2  143.51,62.23 270 top
R1  124.46,71.12 90 top
R2  144.78,77.47 90 top
R3  13.97,34.29 90 top
R4  17.78,34.29 90 top
R5  105.41,120.65 90 top
R6  109.22,120.65 90 top
R7  113.03,120.65 90 top
R8  116.84,120.65 90 top
R9  120.65,120.65 90 top
R10  124.46,120.65 90 top
R11  139.7,63.5 270 top
R12  133.35,40.64 180 top
R13  149.86,76.2 90 top
R14  151.13,68.58 180 top
R15  127,63.5 0 top
R16  147.32,58.42 90 top
R21  134.62,81.28 0 top
R23  129.54,77.47 270 top

### Tracks (layer width: path | path; a pad name or v marks a point on that pad's centre or on a via)
!ACLR
  Top 0.356: ACB2P.7 34.29,118.11 34.29,107.95 30.1,103.76 E1.76
!IB00
  Top 0.356: ACB1P.17 45.72,107.95 37.6,99.83 E1.64
!IB01
  Top 0.356: ACB1P.15 43.18,107.95 36.1,100.87 E1.67
!IB02
  Top 0.356: ACB1P.13 40.64,107.95 35.1,102.41 E1.69
!IB03
  Top 0.356: ACB1P.11 38.1,107.95 34.1,103.95 E1.71
!IB04
  Top 0.356: ACB1P.9 35.56,107.95 31.11,103.5 31.11,95.89 32.1,94.9 E1.75
!IB05
  Top 0.356: ACB1P.7 33.02,107.95 27.94,102.87 27.94,91.44 28.79,90.59 E1.77
!IB06
  Top 0.356: ACB1P.5 30.48,107.95 25.4,102.87 25.4,91.44 27.25,89.59 E1.79
!IB07
  Top 0.356: ACB1P.3 27.94,107.95 22.86,102.87 22.86,91.44 25.71,88.59 E1.81
!IB08
  Top 0.356: ACB1P.1 25.4,107.95 20.32,102.87 20.32,91.44 24.67,87.09 E1.84
!IB09
  Top 0.356: ACB2P.17 46.99,118.11 46.99,107.95 38.1,99.06 E1.63
!IB10
  Top 0.356: ACB2P.15 44.45,118.11 44.45,107.95 37.1,100.6 E1.65
!IB11
  Top 0.356: ACB2P.13 41.91,118.11 41.91,107.95 35.6,101.64 E1.68
!IRQ
  Top 0.356: ACB2P.9 36.83,118.11 36.83,107.95 33.6,104.72 E1.72
!LINE
  Top 0.356: ACB2P.1 26.67,118.11 26.67,107.95 21.59,102.87 21.59,91.44 25.44,87.59 E1.83
!RUN
  Top 0.356: ACB2P.5 31.75,118.11 31.75,107.95 26.67,102.87 26.67,91.44 28.02,90.09 E1.78
!SKIP
  Top 0.356: ACB2P.11 39.37,118.11 39.37,107.95 34.6,103.18 E1.70
!TTINST
  Top 0.356: ACB2P.3 29.21,118.11 29.21,107.95 24.13,102.87 24.13,91.44 26.48,89.09 E1.80
-15V
  Top 0.356: E2.12 136.21,70.17 R1.1 124.46,66.04 R15.1
  Bottom 0.356: E2.12 142.24,76.2 157.48,76.2 J1.EE | J3.1 15.11,45.72 104.14,45.72 R15.1
AC00
  Top 0.356: BAC1P.17 113.03,72.39 44.45,72.39 42.6,74.24 E1.22
AC01
  Top 0.356: BAC1P.15 111.76,73.66 44.45,73.66 43.1,75.01 E1.23
AC02
  Top 0.356: BAC1P.13 110.49,74.93 44.45,74.93 43.6,75.78 E1.24
AC03
  Top 0.356: BAC1P.11 109.22,76.2 44.45,76.2 44.1,76.55 E1.25
AC04
  Top 0.356: BAC1P.9 110.07,79.59 E1.27
AC05
  Top 0.356: BAC1P.7 108.03,80.09 E1.28
AC06
  Top 0.356: BAC1P.5 105.99,80.59 E1.29
AC07
  Top 0.356: BAC1P.3 103.95,81.09 E1.30
AC08
  Top 0.356: BAC1P.1 101.91,81.59 51.76,81.59 50.8,81.59 E1.31
AC09
  Top 0.356: BAC2P.17 143.51,113.03 143.51,110.49 128.27,110.49 99.87,82.09 E1.32
AC10
  Top 0.356: BAC2P.15 140.97,113.03 127,113.03 96.56,82.59 E1.33
AC11
  Top 0.356: BAC2P.13 139.7,114.3 127,114.3 96.29,83.59 E1.35
BD109
  Top 0.356: BAUD.25 34.1,62.04 E1.5
BD150
  Top 0.356: BAUD.23 34.6,60 E1.6
BD300
  Top 0.356: BAUD.21 35.1,57.96 E1.7
BD600
  Top 0.356: BAUD.19 35.6,55.92 E1.8
BD1200
  Top 0.356: BAUD.17 36.1,57.88 E1.9
BD2400
  Top 0.356: BAUD.15 36.6,59.92 E1.10
BD4800
  Top 0.356: BAUD.13 37.6,61.46 E1.12
BD9600
  Top 0.356: BAUD.11 38.1,63.5 E1.13
BD19200
  Top 0.356: BAUD.9 38.6,65.54 E1.14
BD38400
  Top 0.356: BAUD.7 39.6,67.08 E1.16
BD57600
  Top 0.356: BAUD.5 40.1,69.12 E1.17
BD115200
  Top 0.356: BAUD.3 41.1,70.66 E1.19
BD230400
  Top 0.356: BAUD.1 41.6,72.7 E1.20
CLK
  Top 0.356: OSC.5 OSC1.8 66.04,92.71 62.42,89.09 E1.46
DS0  (via drill 0.81)
  Top 0.356: DS0.2 26.67,39.37 v26.67,46.99 | v30.48,73.66 32.6,75.78 E1.2
  Bottom 0.356: v26.67,46.99 24.13,49.53 24.13,57.15 27.94,60.96 27.94,71.12 v30.48,73.66
DS1  (via drill 0.81)
  Top 0.356: DS1.2 29.21,39.37 v29.21,46.99 | v30.48,71.12 29.21,72.39 29.21,74.93 32.1,77.82 E1.1
  Bottom 0.356: v29.21,46.99 25.4,50.8 25.4,57.15 29.21,60.96 29.21,69.85 v30.48,71.12
DS2  (via drill 0.81)
  Top 0.356: DS2.2 31.75,39.37 v31.75,46.99 | v30.48,68.58 27.94,71.12 27.94,74.93 30.1,77.09 E1.100
  Bottom 0.356: v31.75,46.99 26.67,52.07 26.67,57.15 30.48,60.96 v30.48,68.58
DSRDTR
  Top 0.356: E3.13 138.43,54.61 151.13,54.61 154.94,58.42 154.94,71.12 J1.DD
GND  (via drill 0.81)
  Top 0.356: ACB2P.20 49.53,120.65 49.53,113.03 | 49.53,113.03 ACB1P.20 | OSC.4 49.53,113.03 | R3.2 13.44,35.77 J2.B12 7.69,37.26 J2.S1 | PROG1.2 17.78,76.2 23.17,81.59 E1.95 | J2.S2 7.61,30.19 J2.A12 | R3.2 R4.2 | PROG1.10 R4.2 | BMB1P.20 100.33,113.03 100.33,120.65 BMB2P.20 105.41,121.92 | 105.41,121.92 109.22,121.92 | 109.22,121.92 113.03,121.92 | 113.03,121.92 116.84,121.92 | 116.84,121.92 120.65,121.92 | 120.65,121.92 124.46,121.92 | 124.46,121.92 BAC2P.2 | R5.2 105.41,121.92 | R6.2 109.22,121.92 | R7.2 113.03,121.92 | R8.2 116.84,121.92 | R9.2 120.65,121.92 | R10.2 124.46,121.92 | J1.B 154.62,43.5 C17.1 141.92,43.5 140.97,44.45 140.97,49.53 138.43,49.53 E3.15 | J3.2 12.07,42.38 J3.3 13.97,38.78 R3.2 | DS2.1 DS1.1 DS0.1 18.1,35.56 R4.2 | E2.6 142.24,63.35 arc90 Q2.E | v31.75,91.44 32.38,91.44 32.6,91.66 E1.74 | E1.86 32.75,86.09 v33.66,87 33.66,84.45 v36.83,81.28 37.1,81.01 E1.11 | E1.59 40.1,91.98 v40.64,91.44 39.37,90.17 39.37,87.63 41.91,85.09 E1.38 | v41.91,88.9 43.22,87.59 E1.43 | v44.45,78.74 44.8,79.09 E1.26
  Bottom 0.356: ACB1P.2 ACB1P.4 ACB1P.6 ACB1P.8 ACB1P.10 ACB1P.12 ACB1P.14 ACB1P.16 ACB1P.18 ACB1P.20 49.53,113.03 74.93,113.03 BMB1P.2 BMB1P.4 BMB1P.6 BMB1P.8 BMB1P.10 BMB1P.12 BMB1P.14 BMB1P.16 BMB1P.18 BMB1P.20 BAC1P.2 BAC1P.4 BAC1P.6 BAC1P.8 BAC1P.10 BAC1P.12 BAC1P.14 BAC1P.16 BAC1P.18 BAC1P.20 153.67,111.76 | ACB2P.2 ACB2P.4 ACB2P.6 ACB2P.8 ACB2P.10 ACB2P.12 ACB2P.14 ACB2P.16 ACB2P.18 ACB2P.20 BMB2P.2 BMB2P.4 BMB2P.6 BMB2P.8 BMB2P.10 BMB2P.12 BMB2P.14 BMB2P.16 BMB2P.18 BMB2P.20 | OSC.4 OSC1.7 58.42,92.71 v44.45,78.74 | DAT1P.2 DAT1P.4 DAT1P.6 DAT1P.8 DAT1P.10 DAT1P.12 DAT1P.14 DAT1P.16 DAT1P.18 DAT1P.20 49.53,8.89 49.53,17.78 | BAC2P.2 BAC2P.4 BAC2P.6 BAC2P.8 BAC2P.10 BAC2P.12 BAC2P.14 BAC2P.16 BAC2P.18 BAC2P.20 153.67,120.65 153.67,111.76 | DAD1P.2 DAD1P.4 DAD1P.6 DAD1P.8 DAD1P.10 DAD1P.12 DAD1P.14 DAD1P.16 DAD1P.18 DAD1P.20 153.67,8.89 153.67,17.78 | PROG1.10 16.51,59.69 16.51,67.31 PROG1.2 25.4,76.2 41.91,76.2 v44.45,78.74 | C3.2 v36.83,81.28 C4.2 | C1.2 33.97,86.68 v33.66,87 33.97,87.31 C8.2 | C8.2 33.34,89.54 C7.2 v31.75,91.44 | J2.S1 J2.S3 | 153.67,17.78 DAD2P.20 DAD2P.18 DAD2P.16 DAD2P.14 DAD2P.12 DAD2P.10 DAD2P.8 DAD2P.6 DAD2P.4 DAD2P.2 49.53,17.78 | C8.2 38.1,88.9 v40.64,91.44 C6.2 42.23,89.22 v41.91,88.9 42.23,88.58 C2.2 C5.2 42.23,83.5 43.18,82.55 43.18,80.01 v44.45,78.74 | 49.53,17.78 DAT2P.20 DAT2P.18 DAT2P.16 DAT2P.14 DAT2P.12 DAT2P.10 DAT2P.8 DAT2P.6 DAT2P.4 DAT2P.2 18.41,17.78 7.61,28.59 J2.S2 J2.S4 | J1.C J1.A | J1.A J1.B | 153.67,111.76 161.29,104.14 160.02,104.14 160.02,90.17 | 160.02,90.17 160.02,41.91 | 160.02,41.91 160.02,24.13 153.67,17.78
  Bottom 0.356: J1.VV J1.UU 160.02,90.17 | J1.A 160.02,41.91 | E2.13 137.16,71.12 E2.6 | E2.6 E2.7 147.32,68.58 E2.9 | E3.15 E2.6
  pour Bottom: 0,0 177.8,0 177.8,127 0,127
  pour Top: 0,0 177.8,0 177.8,127 0,127
IN_20MA  (via drill 0.81)
  Top 0.356: R2.1 E2.10 146.05,72.39 146.05,64.77 148.59,64.77 151.13,62.23 v151.13,60.96
  Bottom 0.356: J1.H 157.48,50.8 152.4,50.8 149.86,53.34 149.86,59.69 v151.13,60.96
IN_EIA  (via drill 0.81)
  Top 0.356: Q2.C 147.32,62.23 149.86,59.69 v153.67,59.69 153.67,67.31 153.35,67.31 R14.1
  Bottom 0.356: v153.67,59.69 153.67,57.15 154.94,55.88 157.48,55.88 J1.M
INIT  (via drill 0.81)
  Top 0.356: v13.97,87.63 17.01,84.59 E1.89 | DAD2P.1 130.81,13.97 153.67,13.97 160.02,20.32 160.02,111.76 153.67,118.11 153.67,120.65 130.81,120.65 BAC2P.1 | v127,118.11 125.88,119.23 R10.1
  Bottom 0.356: BAC2P.1 128.27,118.11 v127,118.11 25.4,118.11 13.97,106.68 v13.97,87.63
IOP1  (via drill 0.81)
  Top 0.356: R5.1 v105.41,114.3 | v17.78,82.55 19.32,84.09 E1.90
  Bottom 0.356: BAC2P.11 137.16,114.3 v105.41,114.3 25.4,114.3 17.78,106.68 v17.78,82.55
IOP2  (via drill 0.81)
  Top 0.356: v16.51,90.17 20.09,86.59 E1.85 | R6.1 v109.22,115.57
  Bottom 0.356: BAC2P.9 135.89,115.57 v109.22,115.57 25.4,115.57 16.51,106.68 v16.51,90.17
IOP4  (via drill 0.81)
  Top 0.356: v15.24,88.9 18.55,85.59 E1.87 | R7.1 v113.03,116.84
  Bottom 0.356: BAC2P.7 134.62,116.84 v113.03,116.84 25.4,116.84 15.24,106.68 v15.24,88.9
MB00  (via drill 0.81)
  Top 0.356: v64.77,93.98 60.38,89.59 E1.47
  Bottom 0.356: BMB1P.17 96.52,105.41 86.36,95.25 68.58,95.25 67.31,93.98 v64.77,93.98
MB01  (via drill 0.81)
  Top 0.356: v62.23,95.25 57.07,90.09 E1.48
  Bottom 0.356: BMB1P.15 93.98,104.78 85.72,96.52 68.58,96.52 67.31,95.25 v62.23,95.25
MB02  (via drill 0.81)
  Top 0.356: v64.77,97.79 62.23,97.79 55.03,90.59 E1.49
  Bottom 0.356: BMB1P.13 91.44,104.14 85.09,97.79 v64.77,97.79
MB03  (via drill 0.81)
  Top 0.356: v60.96,101.6 57.15,101.6 55.88,100.33 48.26,100.33 42.6,94.67 E1.54
  Bottom 0.356: BMB1P.9 86.36,105.41 82.55,101.6 v60.96,101.6
MB04  (via drill 0.81)
  Top 0.356: v54.61,105.41 53.34,104.14 48.26,104.14 41.1,96.98 E1.57
  Bottom 0.356: BMB1P.5 81.28,105.41 74.93,105.41 73.66,106.68 55.88,106.68 v54.61,105.41
MB05  (via drill 0.81)
  Top 0.356: v50.8,109.22 49.53,107.95 48.26,107.95 39.1,98.79 E1.61
  Bottom 0.356: BMB1P.1 74.93,110.49 52.07,110.49 v50.8,109.22
MB06  (via drill 0.81)
  Top 0.356: BMB2P.15 90.17,115.57 v90.17,105.41 | v63.5,99.06 57.15,99.06 55.88,97.79 49.53,97.79 46.1,94.36 E1.50
  Bottom 0.356: v90.17,105.41 83.82,99.06 v63.5,99.06
MB07  (via drill 0.81)
  Top 0.356: BMB2P.11 87.63,118.11 v87.63,104.78 | v62.23,100.33 57.15,100.33 55.88,99.06 48.26,99.06 43.6,94.4 E1.52
  Bottom 0.356: v62.23,100.33 83.17,100.33 v87.63,104.78
MB08  (via drill 0.81)
  Top 0.356: BMB2P.7 85.09,118.11 v85.09,107.31 | v59.69,102.87 57.15,102.87 55.88,101.6 48.26,101.6 42.1,95.44 E1.55
  Bottom 0.356: v85.09,107.31 83.82,106.05 83.82,104.14 82.55,102.87 v59.69,102.87
MB09  (via drill 0.81)
  Top 0.356: BMB2P.5 82.55,118.11 v82.55,106.68 | v55.88,104.14 54.61,102.87 48.26,102.87 41.6,96.21 E1.56
  Bottom 0.356: v82.55,106.68 82.55,104.14 74.93,104.14 73.66,105.41 57.15,105.41 v55.88,104.14
MB10  (via drill 0.81)
  Top 0.356: BMB2P.3 80.01,118.11 v80.01,106.68 | v53.34,106.68 52.07,105.41 48.26,105.41 40.6,97.75 E1.58
  Bottom 0.356: v80.01,106.68 74.93,106.68 73.66,107.95 54.61,107.95 v53.34,106.68
MB11  (via drill 0.81)
  Top 0.356: BMB2P.1 77.47,118.11 v77.47,107.95 | v52.07,107.95 50.8,106.68 48.26,106.68 39.6,98.02 E1.60
  Bottom 0.356: v77.47,107.95 74.93,107.95 73.66,109.22 53.34,109.22 v52.07,107.95
N$1
  Top 0.356: R4.1 17.78,33.02 16.51,31.75 12.7,31.75 11.93,32.52 J2.B5
N$2
  Top 0.356: R15.2 E2.2
N$5
  Top 0.356: J2.A5 13.79,33.52 R3.1
N$7
  Top 0.356: E2.16 R23.2 134.94,76.52 R21.2
N$11
  Top 0.356: R16.2 147,59.69 143.51,59.69 142.41,60.79 Q2.B
N$15
  Top 0.356: R11.1 E2.5
N$16
  Top 0.356: E3.6 C17.2
N$17
  Top 0.356: E3.1 127.32,46.04 C14.1
N$827
  Top 0.356: E3.3 133.35,49.53 130.81,49.53 130.81,45.72 129.54,44.45 C14.2
N$914
  Top 0.356: E3.5 139.38,47.94 C15.2
N$915
  Top 0.356: E3.4 137.48,47.94 C15.1
N$916
  Top 0.356: C16.1 E3.2
R_RUN  (via drill 0.81)
  Top 0.356: E3.11 133.35,64.77 133.35,67.31 130.81,67.31 E2.1 | E1.40 67.04,86.09 v69.22,88.27
  Bottom 0.356: v69.22,88.27 107.31,88.27 E2.1
READER_RUN+
  Top 0.356: J1.PP 157.48,83.82 132.08,83.82 R21.1 R23.1 126.68,78.42 124.46,76.2 R1.2
RTS
  Bottom 0.356: J1.V 140.97,62.23 E3.14
RX_20MA+  (via drill 0.81)
  Top 0.356: v149.86,40.64 R12.1 | J1.K 157.48,50.8 152.72,50.8 D1.C 152.08,50.8 v149.86,50.8
  Bottom 0.356: v149.86,50.8 v149.86,40.64
RX_20MA-
  Top 0.356: J1.S 157.48,58.42 157.48,53.34 152.58,53.34 arc-90 D1.A
  Bottom 0.356: E2.8 157.48,66.04 157.48,60.96 J1.S
RX_DATA  (via drill 0.81)
  Top 0.356: v101.6,48.26 v106.68,43.18 | E1.42 62.96,87.09 v64.14,88.27
  Bottom 0.356: 66.04,86.36 v101.6,48.26 | v106.68,43.18 111.76,38.1 149.86,38.1 154.94,43.18 157.48,43.18 157.48,45.72 J1.E
  Bottom 0.406: v64.14,88.27 66.04,86.36
RXD232
  Top 0.356: E3.8 154.94,48.26 J1.J
RXDTTL
  Top 0.356: E3.9 R16.1
TCK  (via drill 0.81)
  Top 0.356: PROG1.1 11.43,72.39 11.43,95.25 v19.05,102.87 | v38.73,91.44 38.6,91.58 E1.62
  Bottom 0.356: v19.05,102.87 25.4,99.06 31.75,99.06 35.56,94.61 v38.73,91.44
TDI
  Top 0.356: PROG1.9 16.51,59.69 24.13,59.69 33.6,69.16 E1.4
TDO  (via drill 0.7, 0.81)
  Top 0.356: PROG1.3 16.51,67.31 16.51,69.85 12.7,73.66 12.7,93.98 v19.05,100.33 | v32.23,96.52 33.1,95.65 E1.73
  Bottom 0.356: v19.05,100.33 25.4,96.52 v32.23,96.52
TMS  (via drill 0.81)
  Top 0.356: PROG1.5 16.51,62.23 19.05,62.23 26.67,69.85 v26.67,78.11 | v38.73,78.74 39.1,78.38 E1.15
  Bottom 0.356: v26.67,78.11 27.3,78.74 v38.73,78.74
TS1
  Top 0.356: BAC2P.3 129.54,116.84 127,116.84 124.46,114.3 120.65,114.3 | R9.1 120.65,114.3 | 120.65,114.3 90.94,84.59 55.11,84.59 54.61,84.59 E1.37
TS3  (via drill 0.81)
  Top 0.356: R8.1 v116.84,113.03 | BAC2P.5 130.81,115.57 127,115.57 124.46,113.03 v123.19,113.03 94.25,84.09 E1.36
  Bottom 0.356: v116.84,113.03 v123.19,113.03
TX_20MA+
  Top 0.356: J1.AA 157.48,71.12 157.48,73.66 154.94,73.66 149.86,78.74 R13.2
TX_20MA-
  Top 0.356: E2.11 142.24,78.74 146.05,82.55 153.67,82.55 154.94,81.28 157.48,81.28 J1.KK
TXD232
  Top 0.356: E3.7 146.05,46.99 J1.F
TXDTTL  (via drill 0.81)
  Top 0.356: E3.10 139.7,60.96 R11.2 | E1.41 65,86.59 v66.67,88.27
  Bottom 0.356: v66.67,88.27 68.58,86.36 106.68,86.36 127,66.04 127,55.88 128.27,54.61 143.51,54.61 E3.10
VCC  (via drill 0.81)
  Top 0.356: 5.7,34.29 5.7,31.75 5.95,31.5 J2.A9 9.14,31.5 10.16,30.48 21.59,30.48 | J2.B9 5.95,34.54 5.7,34.29 | PROG1.4 16.51,64.77 13.97,64.77 5.7,56.5 5.7,34.29 | OSC1.14 71.12,106.68 71.12,97.79 | 71.12,97.79 71.12,87.63 69.08,85.59 E1.39 42.68,85.59 40.64,87.63 40.64,90.17 44.45,90.17 | R12.2 122.24,30.48 35.56,30.48 | 35.56,30.48 21.59,30.48 | E2.15 133.35,74.93 140.97,74.93 140.97,72.39 143.51,72.39 143.51,77.47 144.46,78.42 R2.2 145.1,78.74 147.32,78.74 149.86,76.2 R13.1 150.18,70.8 R14.2 | E3.16 125.73,52.07 125.73,43.18 128.27,40.64 R12.2 | C16.2 132.4,43.18 R12.2 | DS2.3 34.29,40.64 35.56,39.37 35.56,30.48 | E1.91 31.52,83.59 31.75,83.36 v31.75,82.55 31.75,80.01 33.1,78.66 E1.3 33.1,73.74 v31.75,72.39 | v36.83,91.44 33.48,88.09 E1.82 | v41.91,81.28 40.6,79.97 E1.18 | v44.45,88.9 44.45,90.17 | v36.83,91.44 36.6,91.67 E1.66 | 44.45,90.17 44.1,90.52 E1.51 | v36.83,91.44 36.83,86.36 v41.91,81.28 | v41.91,81.28 43.72,83.09 E1.34 | v44.45,81.28 v41.91,81.28 | C9.1 21.59,30.48 | C10.1 71.12,97.79
  Bottom 0.356: v41.91,81.28 C4.1 40.32,81.6 39.37,82.55 34.29,82.55 33.02,81.6 C3.1 32.07,82.55 v31.75,82.55 32.07,82.87 C1.1 C8.1 | C7.1 v36.83,91.44 | E3.16 133.35,59.69 133.35,72.39 E2.15 | DS2.3 DS1.3 DS0.3 | C6.1 44.13,89.22 v44.45,88.9 44.13,88.58 C2.1 C5.1 44.13,81.6 v44.45,81.28 | PROG1.4 26.67,74.93 31.75,74.93 v31.75,72.39
X8_RATE
  Top 0.356: BAUD.2 59.69,54.61 59.69,57.15 45.72,71.12 44.45,71.12 42.1,73.47 E1.21
  Bottom 0.356: BAUD.26 BAUD.24 BAUD.22 BAUD.20 BAUD.18 BAUD.16 BAUD.14 BAUD.12 BAUD.10 BAUD.8 BAUD.6 BAUD.4 BAUD.2

### Text on the board
tPlace: Posibus Termination | 110 | 150 | 300 | 600 | 1200 | 2400 | 4800 | 9600 | 19200 | 38400 | 57600 | 115200 | 230400 | Current Loop Supply | Center Positive | 15V 250mA | DEV | ADDR | 000 | 03-04 | 001 | 40-41 | 1 | 010 | 42-43 | 011 | 44-45 | 100 | 46-47 | 101 | 11-12 | 0 | 110 | 30-31 | 111 | 32-33 | DEV